# Altium schematic sheet HBridge_Design.SchDoc
size A; SheetNumber: 1; SheetTotal: 2
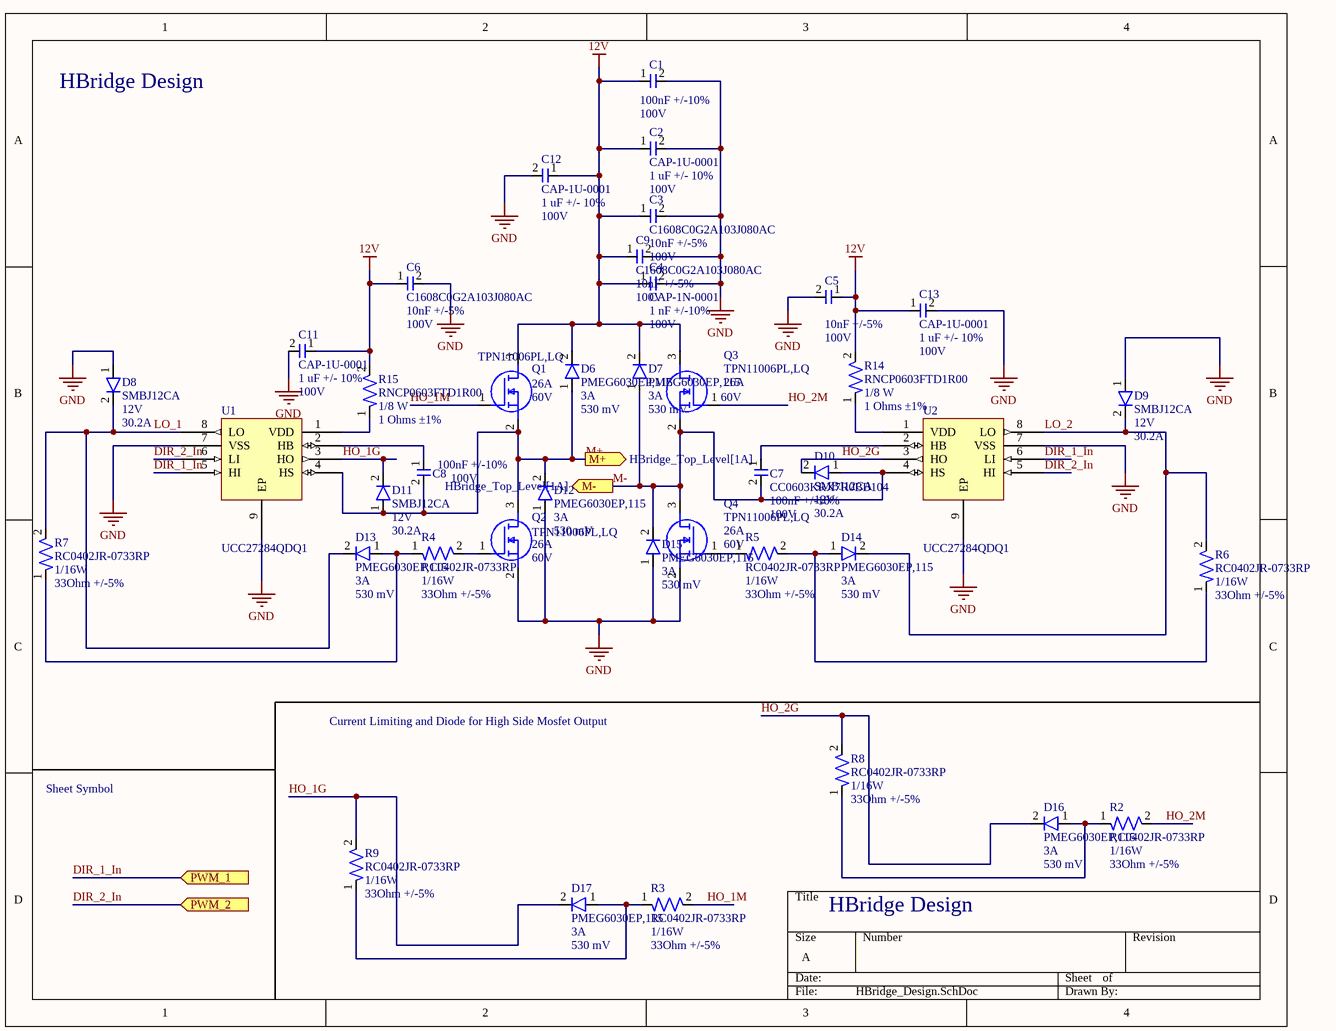
[diagram p0: HBridge_Design.SchDoc]

## Parts
C1  Capacitance: 100nF +/-10%  Voltage Rating: 100V  [CAP-0603]  (hidden comment: CC0603KRX7R0BB104)
C2  CAP-1U-0001  Capacitance: 1 uF +/- 10%  Voltage: 100V  [CAP-1206 - duplicate]
C3  C1608C0G2A103J080AC  Capacitance: 10nF +/-5%  Voltage Rating: 100V  [CAP-0603]
C4  CAP-1N-0001  Capacitance: 1 nF +/-10%  Voltage: 100V  [CAP-0603]
C5  Capacitance: 10nF +/-5%  Voltage Rating: 100V  [CAP-0603]  (hidden comment: C1608C0G2A103J080AC)
C6  C1608C0G2A103J080AC  Capacitance: 10nF +/-5%  Voltage Rating: 100V  [CAP-0603]
C7  CC0603KRX7R0BB104  Capacitance: 100nF +/-10%  Voltage Rating: 100V  [CAP-0603]
C8  Capacitance: 100nF +/-10%  Voltage Rating: 100V  [CAP-0603]  (hidden comment: CC0603KRX7R0BB104)
C9  C1608C0G2A103J080AC  Capacitance: 10nF +/-5%  Voltage Rating: 100V  [CAP-0603]
C11  CAP-1U-0001  Capacitance: 1 uF +/- 10%  Voltage: 100V  [CAP-1206 - duplicate]
C12  CAP-1U-0001  Capacitance: 1 uF +/- 10%  Voltage: 100V  [CAP-1206 - duplicate]
C13  CAP-1U-0001  Capacitance: 1 uF +/- 10%  Voltage: 100V  [CAP-1206 - duplicate]
D6  PMEG6030EP,115  Current Rating: 3A  Vf (Voltage Forward): 530 mV  [DIO-SOD128]
D7  PMEG6030EP,115  Current Rating: 3A  Vf (Voltage Forward): 530 mV  [DIO-SOD128]
D8  SMBJ12CA  Standoff Voltage: 12V  Current Rating: 30.2A  [DO-214AA (SMBJ)]
D9  SMBJ12CA  Standoff Voltage: 12V  Current Rating: 30.2A  [DO-214AA (SMBJ)]
D10  SMBJ12CA  Standoff Voltage: 12V  Current Rating: 30.2A  [DO-214AA (SMBJ)]
D11  SMBJ12CA  Standoff Voltage: 12V  Current Rating: 30.2A  [DO-214AA (SMBJ)]
D12  PMEG6030EP,115  Current Rating: 3A  Vf (Voltage Forward): 530 mV  [DIO-SOD128]
D13  PMEG6030EP,115  Current Rating: 3A  Vf (Voltage Forward): 530 mV  [DIO-SOD128]
D14  PMEG6030EP,115  Current Rating: 3A  Vf (Voltage Forward): 530 mV  [DIO-SOD128]
D15  PMEG6030EP,115  Current Rating: 3A  Vf (Voltage Forward): 530 mV  [DIO-SOD128]
D16  PMEG6030EP,115  Current Rating: 3A  Vf (Voltage Forward): 530 mV  [DIO-SOD128]
D17  PMEG6030EP,115  Current Rating: 3A  Vf (Voltage Forward): 530 mV  [DIO-SOD128]
Q1  TPN11006PL,LQ  Id-Continuous: 26A  VDS-Max: 60V  [NMOS-8TSON]
Q2  TPN11006PL,LQ  Id-Continuous: 26A  VDS-Max: 60V  [NMOS-8TSON]
Q3  TPN11006PL,LQ  Id-Continuous: 26A  VDS-Max: 60V  [NMOS-8TSON]
Q4  TPN11006PL,LQ  Id-Continuous: 26A  VDS-Max: 60V  [NMOS-8TSON]
R2  RC0402JR-0733RP  Power Rating: 1/16W  Resistance: 33Ohm +/-5%  [RES-0402]
R3  RC0402JR-0733RP  Power Rating: 1/16W  Resistance: 33Ohm +/-5%  [RES-0402]
R4  RC0402JR-0733RP  Power Rating: 1/16W  Resistance: 33Ohm +/-5%  [RES-0402]
R5  RC0402JR-0733RP  Power Rating: 1/16W  Resistance: 33Ohm +/-5%  [RES-0402]
R6  RC0402JR-0733RP  Power Rating: 1/16W  Resistance: 33Ohm +/-5%  [RES-0402]
R7  RC0402JR-0733RP  Power Rating: 1/16W  Resistance: 33Ohm +/-5%  [RES-0402]
R8  RC0402JR-0733RP  Power Rating: 1/16W  Resistance: 33Ohm +/-5%  [RES-0402]
R9  RC0402JR-0733RP  Power Rating: 1/16W  Resistance: 33Ohm +/-5%  [RES-0402]
R14  RNCP0603FTD1R00  Power: 1/8 W  Resistance: 1 Ohms ±1%  [RES-0603]
R15  RNCP0603FTD1R00  Power: 1/8 W  Resistance: 1 Ohms ±1%  [RES-0603]
U1  UCC27284QDQ1  [IC-BUCK-8SOIC]
U2  UCC27284QDQ1  [IC-BUCK-8SOIC]

## Ports
M+ (out, see HBridge_Top_Level[1A]), M- (out, see HBridge_Top_Level[1A]), PWM_1 (in, see HBridge_Top_Level[3C]), PWM_2 (in, see HBridge_Top_Level[3B])

## Nets
12V: C1.1 C2.1 C3.1 C4.1 C5.1 C6.1 C9.1 C11.1 C12.1 C13.1 D6.2 D7.2 Q1.3(D) Q3.3(D) R14.2 R15.2
GND: C1.2 C2.2 C3.2 C4.2 C5.2 C6.2 C9.2 C11.2 C12.2 C13.2 D8.1 D9.1 D12.1 D15.1 Q2.2(S) Q4.2(S) U1.7(VSS) U1.9(EP) U2.7(VSS) U2.9(EP)
DIR_1_In: U1.5(HI) U2.6(LI) ; port PWM_1
DIR_2_In: U1.6(LI) U2.5(HI) ; port PWM_2
HO_1G: D11.2 D17.2 R9.2 U1.3(HO)
HO_1M: Q1.1(G) R3.2
HO_2G: D10.2 D16.2 R8.2 U2.3(HO)
HO_2M: Q3.1(G) R2.2
LO_1: D8.2 D13.2 R7.2 U1.8(LO)
LO_2: D9.2 D14.2 R6.2 U2.8(LO)
M+: C8.2 D6.1 D11.1 D12.2 Q1.2(S) Q2.3(D) U1.4(HS) ; port M+
M-: C7.2 D7.1 D10.1 D15.2 Q3.2(S) Q4.3(D) U2.4(HS) ; port M-
NetC7_1: C7.1 U2.2(HB)
NetC8_1: C8.1 U1.2(HB)
NetD13_1: D13.1 R4.1 R7.1
NetD14_1: D14.1 R5.2 R6.1
NetD16_1: D16.1 R2.1 R8.1
NetD17_1: D17.1 R3.1 R9.1
NetQ2_1: Q2.1(G) R4.2
NetQ4_1: Q4.1(G) R5.1
NetR14_1: R14.1 U2.1(VDD)
NetR15_1: R15.1 U1.1(VDD)

## Notes on the sheet
- HBridge Design
- Current Limiting and Diode for High Side Mosfet Output
- Sheet Symbol

## Library data of the parts
C1 C7 C8 = CAP-100N-0001: CAP CER 0.1UF 100V X7R 0603; Manufacturer: YAGEO; Assembled?: no; Manufacturer Part Number: CC0603KRX7R0BB104; Temperature Coefficient: X7R; Package Size: 0603
C2 C11-C13 = CAP-1U-0001: 1 µF ±10% 100V Ceramic Capacitor X7R 1206 (3216 Metric)
C3 C5 C6 C9 = CAP-10N-0002: CAP CER 10000PF 100V C0G 0603; Manufacturer: TDK Corporation; Temperature Coefficient: C0G/NP0; Assembled?: no; Manufacturer Part Number: C1608C0G2A103J080AC; Package Size: 0603
C4 = CAP-1N-0001: 1000 pF ±10% 100V Ceramic Capacitor X7R 0603 (1608 Metric)
D6 D7 D12-D17 = DIO-0.53V-0001: Diode Schottky 60 V 3A Surface Mount SOD-128/CFP5; Manufacturer: Nexperia USA Inc.; Assembled: no; Manufacturer Part Number: PMEG6030EP,115; Package: SOD-128/CFP5
D8-D11 = DIO-19.9V-0001: 19.9V Clamp 30.2A Ipp Tvs Diode Surface Mount DO-214AA (SMBJ); Manufacturer: Littlefuse Inc.; Assembled: No; Breakdown Voltage: 13.3; Manufacturer Part Number: SMBJ12CA; Package: DO-214AA (SMBJ)
Q1-Q4 = NMOS-26A-0001: MOSFET N-CH 60V 200MA SOT23; Manufacturer: Toshiba; FET type: N-Channel; Rds On-Max: 18.1mOhm; Vgs-Max: 20V; Assembled?: no; Manufacturer Part Number: TPN11006PL,LQ; Package: 8-TSON Advance
R2-R9 = RES-33-0001: RES SMD 33 OHM 5% 1/16W 0402; Manufacturer: YAGEO; Assembled?: no; Manufacturer Part Number: RC0402JR-0733RP; Package Size: 0402
R14 R15 = RES-1-0001: 1 Ohms ±1% 0.125W, 1/8W Chip Resistor 0603 (1608 Metric) Anti-Sulfur Thin Film
U1 U2 = IC-GDRV-0001: Gate Drivers Automotive 3-A, 120-V half bridge gate driver with 5-V UVLO and enable 8-SOIC -40 to 125; Manufacturer: Texas Instruments; Assembled?: no; VCC-Max: 16V; VCC-Min: 5.5V; Load Voltage-Max: 120V; Supply Current: 3A; Manufacturer Part Number: UCC27284QDQ1; Package: SOIC-8